# Altium schematic sheet Display Pitch.SchDoc
size A; SheetNumber: 6; SheetTotal: 6
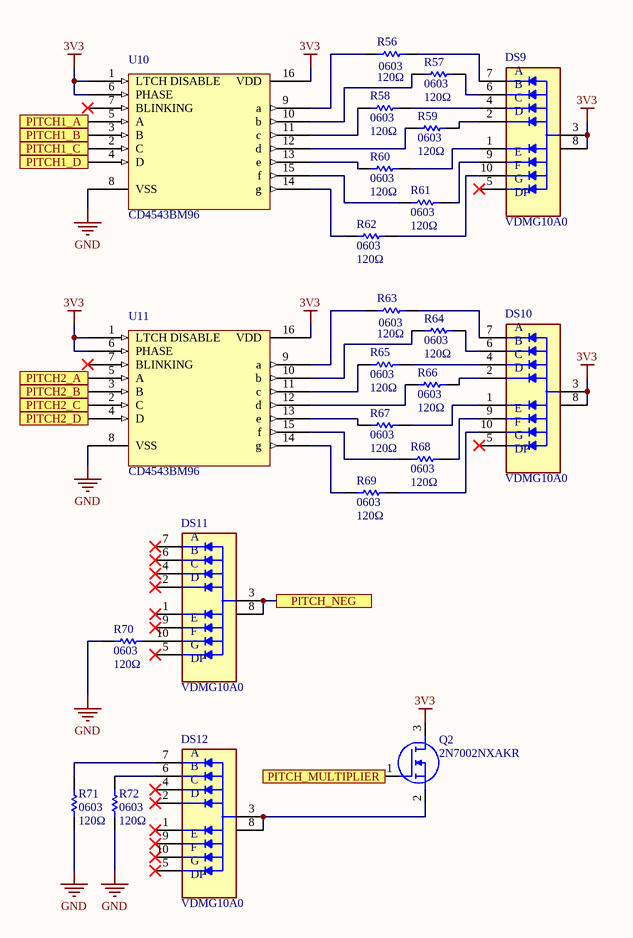
[diagram p0: Display Pitch.SchDoc]

## Parts
DS9  VDMG10A0  [DISPLAY_VDMG10A0]
DS10  VDMG10A0  [DISPLAY_VDMG10A0]
DS11  VDMG10A0  [DISPLAY_VDMG10A0]
DS12  VDMG10A0  [DISPLAY_VDMG10A0]
Q2  2N7002NXAKR  [TO-236AB]
R56  value 120Ω  Package/Footprint: 0603  [RES0603]  (hidden comment: RES_120Ω_0603)
R57  value 120Ω  Package/Footprint: 0603  [RES0603]  (hidden comment: RES_120Ω_0603)
R58  value 120Ω  Package/Footprint: 0603  [RES0603]  (hidden comment: RES_120Ω_0603)
R59  value 120Ω  Package/Footprint: 0603  [RES0603]  (hidden comment: RES_120Ω_0603)
R60  value 120Ω  Package/Footprint: 0603  [RES0603]  (hidden comment: RES_120Ω_0603)
R61  value 120Ω  Package/Footprint: 0603  [RES0603]  (hidden comment: RES_120Ω_0603)
R62  value 120Ω  Package/Footprint: 0603  [RES0603]  (hidden comment: RES_120Ω_0603)
R63  value 120Ω  Package/Footprint: 0603  [RES0603]  (hidden comment: RES_120Ω_0603)
R64  value 120Ω  Package/Footprint: 0603  [RES0603]  (hidden comment: RES_120Ω_0603)
R65  value 120Ω  Package/Footprint: 0603  [RES0603]  (hidden comment: RES_120Ω_0603)
R66  value 120Ω  Package/Footprint: 0603  [RES0603]  (hidden comment: RES_120Ω_0603)
R67  value 120Ω  Package/Footprint: 0603  [RES0603]  (hidden comment: RES_120Ω_0603)
R68  value 120Ω  Package/Footprint: 0603  [RES0603]  (hidden comment: RES_120Ω_0603)
R69  value 120Ω  Package/Footprint: 0603  [RES0603]  (hidden comment: RES_120Ω_0603)
R70  value 120Ω  Package/Footprint: 0603  [RES0603]  (hidden comment: RES_120Ω_0603)
R71  value 120Ω  Package/Footprint: 0603  [RES0603]  (hidden comment: RES_120Ω_0603)
R72  value 120Ω  Package/Footprint: 0603  [RES0603]  (hidden comment: RES_120Ω_0603)
U10  CD4543BM96  [SOIC127P600X175-16N]
U11  CD4543BM96  [SOIC127P600X175-16N]

## Ports
PITCH1_A (in), PITCH1_B (in), PITCH1_C (in), PITCH1_D (in), PITCH2_A (in), PITCH2_B (in), PITCH2_C (in), PITCH2_D (in), PITCH_MULTIPLIER (in), PITCH_NEG

## Nets
3V3: DS9.3(ANODE) DS9.8(ANODE) DS10.3(ANODE) DS10.8(ANODE) Q2.3(D) U10.1(LTCH_DISABLE) U10.6(PHASE) U10.16(VDD) U11.1(LTCH_DISABLE) U11.6(PHASE) U11.16(VDD)
GND: R70.1 R71.1 R72.1 U10.8(VSS) U11.8(VSS)
PITCH1_A: U10.5(A) ; port PITCH1_A
PITCH1_B: U10.3(B) ; port PITCH1_B
PITCH1_C: U10.2(C) ; port PITCH1_C
PITCH1_D: U10.4(D) ; port PITCH1_D
PITCH2_A: U11.5(A) ; port PITCH2_A
PITCH2_B: U11.3(B) ; port PITCH2_B
PITCH2_C: U11.2(C) ; port PITCH2_C
PITCH2_D: U11.4(D) ; port PITCH2_D
PITCH_MULTIPLIER: Q2.1(G) ; port PITCH_MULTIPLIER
PITCH_NEG: DS11.3(ANODE) DS11.8(ANODE) ; port PITCH_NEG
NetDS9_1: DS9.1(E) R60.2
NetDS9_2: DS9.2(D) R59.2
NetDS9_4: DS9.4(C) R58.2
NetDS9_6: DS9.6(B) R57.2
NetDS9_7: DS9.7(A) R56.2
NetDS9_9: DS9.9(F) R61.2
NetDS9_10: DS9.10(G) R62.2
NetDS10_1: DS10.1(E) R67.2
NetDS10_2: DS10.2(D) R66.2
NetDS10_4: DS10.4(C) R65.2
NetDS10_6: DS10.6(B) R64.2
NetDS10_7: DS10.7(A) R63.2
NetDS10_9: DS10.9(F) R68.2
NetDS10_10: DS10.10(G) R69.2
NetDS11_10: DS11.10(G) R70.2
NetDS12_3: DS12.3(ANODE) DS12.8(ANODE) Q2.2(S)
NetDS12_6: DS12.6(B) R72.2
NetDS12_7: DS12.7(A) R71.2
NetR56_1: R56.1 U10.9(a)
NetR57_1: R57.1 U10.10(b)
NetR58_1: R58.1 U10.11(c)
NetR59_1: R59.1 U10.12(d)
NetR60_1: R60.1 U10.13(e)
NetR61_1: R61.1 U10.15(f)
NetR62_1: R62.1 U10.14(g)
NetR63_1: R63.1 U11.9(a)
NetR64_1: R64.1 U11.10(b)
NetR65_1: R65.1 U11.11(c)
NetR66_1: R66.1 U11.12(d)
NetR67_1: R67.1 U11.13(e)
NetR68_1: R68.1 U11.15(f)
NetR69_1: R69.1 U11.14(g)

Not connected (* = marked no-connect by the designer): DS9 5(DP)*; DS10 5(DP)*; DS11 1(E)* 2(D)* 4(C)* 5(DP)* 6(B)* 7(A)* 9(F)*; DS12 1(E)* 2(D)* 4(C)* 5(DP)* 9(F)* 10(G)*; U10 7(BLINKING)*; U11 7(BLINKING)*

## Library data of the parts
DS9-DS12 = 7 SEG DISPLAY - VDMG10A0: Smart/Normal 7 Seg Numeric LED Display; Manufacturer: Vishay Semiconductors; Package: SMD-10 Vishay; MP: VDMG10A0; Supplier 1: Digi-Key; Manufacturer Part Number: VDMG10A0; RoHS: Yes; Category: LED Displays; Stock 1: 6191; Pricing 1: 1=1.55000, 10=1.38200, 100=1.07760 (USD); Optoelectronic Device Type: SMART/NORMAL 7 SEG NUMERIC LED DISPLAY; REACH SVHC: No SVHC; RoHS Compliant: Yes; ComponentLink1URL: https://datasheet.ciiva.com:443/pdfs/VipMasterIC/IC/VISH/VISH-S-A0001108912/VISH-S-A0001108912-1.pdf?src-supplier=IHS+Markit; ComponentLink1Description: https://datasheet.ciiva.com:443/pdfs/VipMasterIC/IC/VISH/VISH-S-A0001108912/VISH-S-A0001108912-1.pdf?src-supplier=IHS+Markit; ComponentLink2URL: https://datasheet.ciiva.com/24075/vdmx10x0-272413-24075313.pdf?src-supplier=Mouser; ComponentLink2Description: https://datasheet.ciiva.com/24075/vdmx10x0-272413-24075313.pdf?src-supplier=Mouser; ComponentLink3URL: https://datasheet.ciiva.com/23867/vdmx10x0-23867376.pdf?src-supplier=Newark; ComponentLink3Description: https://datasheet.ciiva.com/23867/vdmx10x0-23867376.pdf?src-supplier=Newark; ComponentLink4URL: https://datasheet.ciiva.com/29566/vdmx10x0-29566054.pdf?src-supplier=Digi-Key; ComponentLink4Description: https://datasheet.ciiva.com/29566/vdmx10x0-29566054.pdf?src-supplier=Digi-Key; ComponentLink5URL: https://datasheet.ciiva.com/29566/vdmx10x0-29566055.pdf?src-supplier=Digi-Key; ComponentLink5Description: https://datasheet.ciiva.com/29566/vdmx10x0-29566055.pdf?src-supplier=Digi-Key; ComponentLink6URL: https://datasheet.ciiva.com/29566/vdmx10x0-29566056.pdf?src-supplier=Digi-Key; ComponentLink6Description: https://datasheet.ciiva.com/29566/vdmx10x0-29566056.pdf?src-supplier=Digi-Key; ComponentLink7URL: https://datasheet.ciiva.com/30017/vdmx10x0-30017276.pdf?src-supplier=Avnet; ComponentLink7Description: https://datasheet.ciiva.com/30017/vdmx10x0-30017276.pdf?src-supplier=Avnet; ComponentLink8URL: https://datasheet.ciiva.com/23867/1809851-23867367.pdf?src-supplier=Newark; ComponentLink8Description: https://datasheet.ciiva.com/23867/1809851-23867367.pdf?src-supplier=Newark; ComponentLink9URL: https://datasheet.ciiva.com/22726/1913356-22726255.pdf?src-supplier=Element14; ComponentLink9Description: https://datasheet.ciiva.com/22726/1913356-22726255.pdf?src-supplier=Element14; ComponentLink10URL: https://datasheet.ciiva.com/24208/vdmx10x0-24208888.pdf?src-supplier=Future+Electronics; ComponentLink10Description: https://datasheet.ciiva.com/24208/vdmx10x0-24208888.pdf?src-supplier=Future+Electronics; Supplier Part Number 1: VDMG10A0CT-ND
Q2 = MOSFET N-60V-190mA: Transistor Mosfet N-ch 60V 0.3A 3-PIN TO-263AB T/r; Manufacturer: Nexperia; MF: Nexperia USA Inc.; Value: *; Check_prices: https://www.snapeda.com/parts/2N7002NXAKR/Nexperia/view-part/4480350/?ref=eda; Availability: Good; Package: SOT23-3 Nexperia USA Inc.; SnapEDA_Link: https://www.snapeda.com/parts/2N7002NXAKR/Nexperia/view-part/4480350/?ref=snap; Price: None; Purchase-URL: https://pricing.snapeda.com/search/part/2N7002NXAKR/?ref=eda; MP: 2N7002NXAKR; Supplier 1: Digi-Key; Manufacturer Part Number: 2N7002NXAKR; RoHS: No; Stock 1: 47085; Pricing 1: 1=0.11000, 10=0.09800, 25=0.09360, 100=0.05360, 500=0.03298, 1000=0.02249 (USD); ComponentLink1URL: http://www.farnell.com/datasheets/2842563.pdf?src-supplier=Farnell; ComponentLink1Description: http://www.farnell.com/datasheets/2842563.pdf?src-supplier=Farnell; ComponentLink2URL: http://www.farnell.com/datasheets/2842563.pdf?src-supplier=Element14; ComponentLink2Description: http://www.farnell.com/datasheets/2842563.pdf?src-supplier=Element14; ComponentLink3URL: http://www.farnell.com/datasheets/2842563.pdf?src-supplier=Newark; ComponentLink3Description: http://www.farnell.com/datasheets/2842563.pdf?src-supplier=Newark; Supplier Part Number 1: 1727-8643-1-ND
R56-R72 = RES_120Ω_0603_5%: RES 120 OHM 5% 1/10W 0603; Manufacturer 1: Yageo; Manufacturer Part Number 1: RC0603JR-07120RL; Supplier Part Number 1: 311-120GRCT-ND; Supplier 1: Digi-Key; Mounting Type: SMD
U10 U11 = 7 SEG DISPLAY IC: Seven Segment Decoder/Driver, 4000/14000/40000 Series, Configurable Output, CMOS, PDSO16; Manufacturer: Texas Instruments; Package Body Material: Plastic; Input Conditioning: LATCHED; Number of Functions: 1; Propagation Delay (tpd): 1200ns; Supply Voltage-Max (Vsup): 18V; Supply Voltage-Min (Vsup): 3V; Supply Voltage-Nom (Vsup): 5V; Qualification Status: Not Qualified; Supplier 1: Digi-Key; RoHS: Yes; Category: Decoders and Multiplexers; Stock 1: 1242; Pricing 1: 1=0.44000, 10=0.37800, 25=0.35240, 100=0.28200, 250=0.26184, 500=0.22154, 1000=0.17119 (USD); Package Code: SOP; Number of Pins: 16; Package Shape: Rectangular; Terminal Finish: Nickel; Min Operating Temperature: -55°C; Max Operating Temperature: 125°C; JESD-609 Code: e4; Output Polarity: Configurable; JESD-30 Code: R-PDSO-G16; Logic IC Type: SEVEN SEGMENT DECODER/DRIVER; Moisture Sensitivity Level: 1; Package Style: SMALL OUTLINEMeter; Peak Reflow Temperature (Cel): 260°C; Surface Mount: Yes; Technology: CMOS; Terminal Form: Gull Wing; Terminal Position: DUAL; Length: 9.9mm; Width: 3.9mm; Height - Seated (Max): 1.75mm; Terminal Pitch: 1.27mm; Temperature Grade: MILITARY; REACH SVHC: Yes; RoHS Compliant: Yes; ComponentLink1URL: https://www.ti.com:443/lit/ds/symlink/cd4543b.pdf?src-supplier=IHS+Markit; ComponentLink1Description: https://www.ti.com:443/lit/ds/symlink/cd4543b.pdf?src-supplier=IHS+Markit; ComponentLink2URL: https://datasheet.ciiva.com/15092/getdatasheetpartid-635761-15092907.pdf?src-supplier=Verical; ComponentLink2Description: https://datasheet.ciiva.com/15092/getdatasheetpartid-635761-15092907.pdf?src-supplier=Verical; ComponentLink3URL: https://datasheet.ciiva.com/41457/001013540-da-01-en-ic-bcd-7seg-ltch-cd4543bm96-soic-16-tid-41457278.pdf?src-supplier=Conrad; ComponentLink3Description: https://datasheet.ciiva.com/41457/001013540-da-01-en-ic-bcd-7seg-ltch-cd4543bm96-soic-16-tid-41457278.pdf?src-supplier=Conrad; ComponentLink4URL: https://datasheet.ciiva.com/6612/cd4543b-6612264.pdf?src-supplier=Digi-Key; ComponentLink4Description: https://datasheet.ciiva.com/6612/cd4543b-6612264.pdf?src-supplier=Digi-Key; ComponentLink5URL: https://datasheet.ciiva.com/6612/cd4543b-6612265.pdf?src-supplier=Digi-Key; ComponentLink5Description: https://datasheet.ciiva.com/6612/cd4543b-6612265.pdf?src-supplier=Digi-Key; ComponentLink6URL: https://datasheet.ciiva.com/6612/cd4543b-6612267.pdf?src-supplier=Digi-Key; ComponentLink6Description: https://datasheet.ciiva.com/6612/cd4543b-6612267.pdf?src-supplier=Digi-Key; Supplier Part Number 1: 296-31539-1-ND; Manufacturer Part Number: CD4543BM96